# Altium schematic sheet 2_usb.SchDoc: USB
size A4; DocumentNumber: 3; SheetNumber: 3; SheetTotal: 11
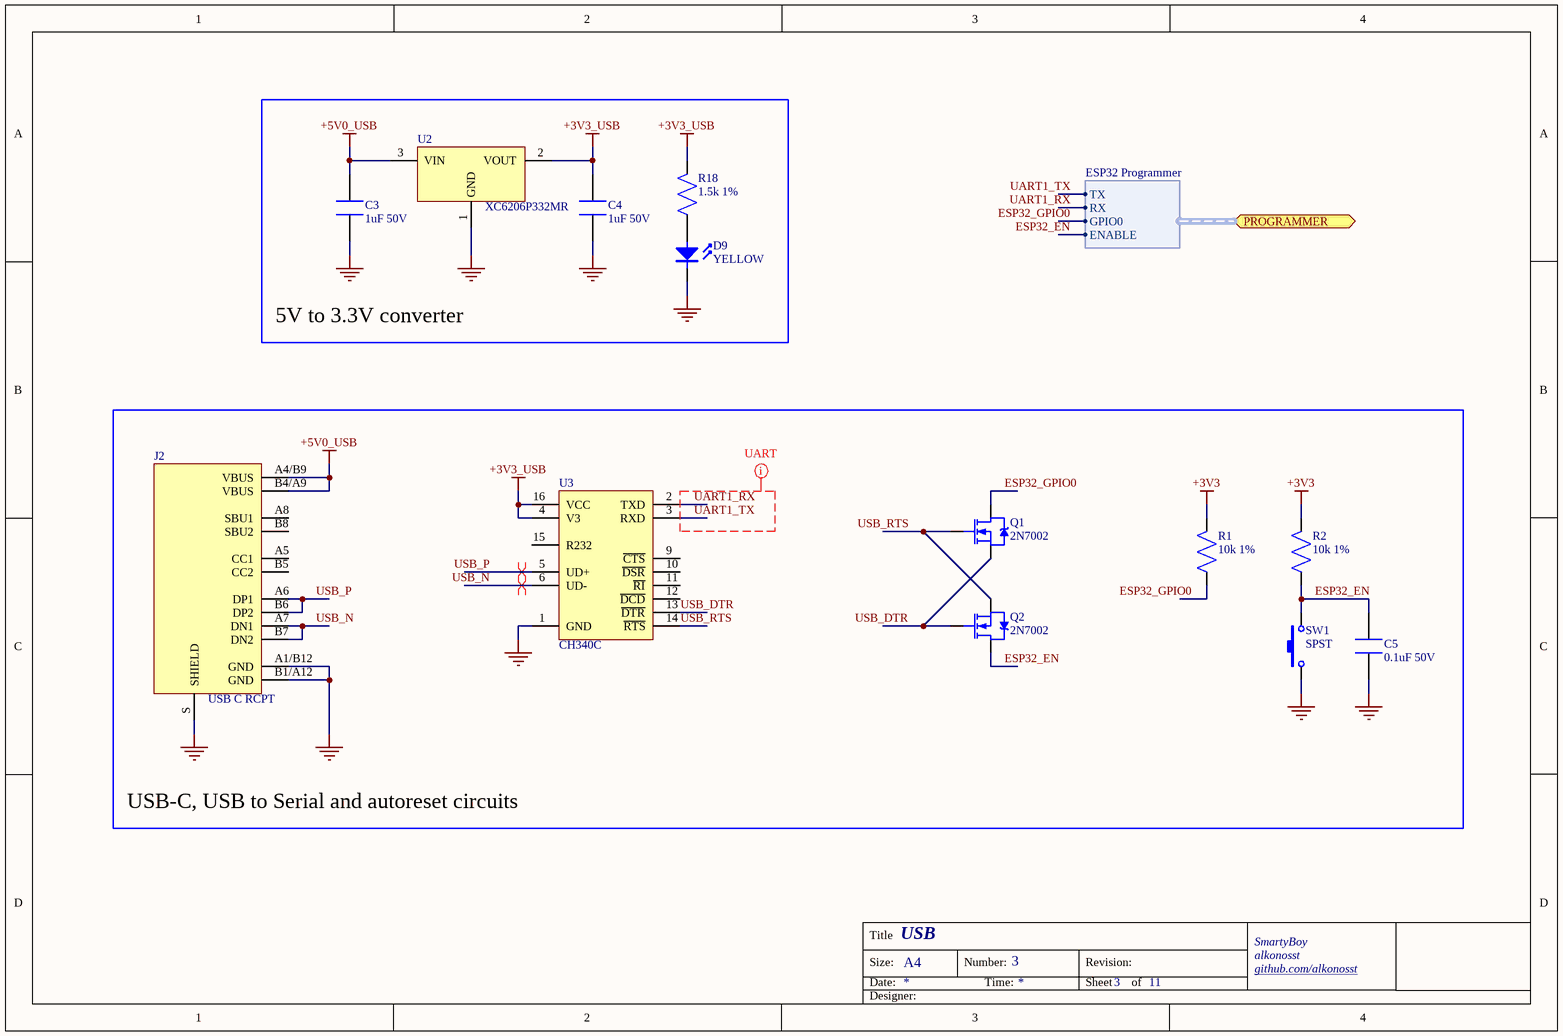
[diagram p0: 2_usb.SchDoc]

## Parts
C3  1uF 50V  [C0603]
C4  1uF 50V  [C0603]
C5  0.1uF 50V  [C0603]
D9  YELLOW  [LED0603-YELLOW]
J2  USB C RCPT  [USB-TYPE-C-RCPT]
Q1  2N7002  [SOT-23-3]
Q2  2N7002  [SOT-23-3]
R1  10k 1%  [R0603]
R2  10k 1%  [R0603]
R18  1.5k 1%  [R0603]
SW1  SPST  [SW-TS-1187A-B-A-B]
U2  XC6206P332MR  [SOT-23-3]
U3  CH340C  [SOP-16]

## Blocks framed on the sheet
5V to 3.3V converter: C3 C4 D9 R18 U2
USB-C, USB to Serial and autoreset circuits: C5 J2 Q1 Q2 R1 R2 SW1 U3

## Ports
PROGRAMMER (bidir, harness ESP32 Programmer)

## Harnesses
ESP32 Programmer: TX, RX, GPIO0, ENABLE

## Nets
+3V3: R1.2 R2.2
+3V3_USB: C4.1 R18.2 U2.2(VOUT) U3.4(V3) U3.16(VCC)
+5V0_USB: C3.1 J2.A4/B9(VBUS) J2.B4/A9(VBUS) U2.3(VIN)
GND: C3.2 C4.2 C5.2 D9.1 J2.A1/B12(GND) J2.B1/A12(GND) J2.S(SHIELD) SW1.1 U2.1(GND) U3.1(GND)
ESP32_EN: C5.1 Q2.3(D) R2.1 SW1.2 ; port PROGRAMMER.ENABLE
ESP32_GPIO0: Q1.3(D) R1.1 ; port PROGRAMMER.GPIO0
UART1_RX: U3.2(TXD) ; port PROGRAMMER.RX
UART1_TX: U3.3(RXD) ; port PROGRAMMER.TX
USB_DTR: Q1.2(S) Q2.1(G) U3.13(~{DTR})
USB_N: J2.A7(DN1) J2.B7(DN2) U3.6(UD-)
USB_P: J2.A6(DP1) J2.B6(DP2) U3.5(UD+)
USB_RTS: Q1.1(G) Q2.2(S) U3.14(~{RTS})
NetD9_2: D9.2 R18.1

Not connected (* = marked no-connect by the designer): J2 A5(CC1) A8(SBU1) B5(CC2) B8(SBU2); U3 7(NC1) 8(NC2) 9(~{CTS}) 10(~{DSR}) 11(~{RI}) 12(~{DCD}) 15(R232)

## Layout directives
differential pair: USB_N, USB_P
net class UART: UART1_RX, UART1_TX

## Notes on the sheet
- Title
- Size:
- Date:
- A4
- Number:
- Time:
- Revision:
- Sheet
- of
- SmartyBoy
- alkonosst
- github.com/alkonosst <http://github.com/alkonosst>
- Designer:

## Library data of the parts
C3 C4 = CL10A105KB8NNNC: X5R ±10% 50V 1uF 0603 Multilayer Ceramic Capacitors MLCC - SMD/SMT; LCSC part: C15849; Category: Capacitors: Multilayer Ceramic Capacitors MLCC - SMD/SMT
C5 = CC0603KRX7R9BB104: X7R 100nF ±10% 50V 0603 Multilayer Ceramic Capacitors MLCC - SMD/SMT; LCSC part: C14663; Category: Capacitors: Multilayer Ceramic Capacitors MLCC - SMD/SMT
D9 = 19-213/Y2C-CQ2R2L/3T(CY): Yellow 585.5~591.5nm 0603 Light Emitting Diodes (LED); LCSC part: C72038; Category: Optoelectronics: Light Emitting Diodes (LED)
J2 = TYPE-C-31-M-12: Receptacle USB Type C 16 Pins; LCSC part: C165948; Category: Connectors: USB Connectors
Q1 Q2 = 2N7002: 2.5V 250uA 0.115A 60V N Channel 7.5Ω 500mA,10V 0.2W SOT-23(SOT-23-3) MOSFETs; LCSC part: C8545; Category: Transistors: MOSFETs
R1 R2 = 0603WAF1002T5E: ±1% ±100ppm/℃ 10kΩ 0.1W 0603 Chip Resistor - Surface Mount; LCSC part: C25804; Category: Resistors: Chip Resistor - Surface Mount
R18 = 0603WAF1501T5E: 1.5kΩ ±1% ±100ppm/℃ 0.1W 0603 Chip Resistor - Surface Mount; LCSC part: C22843; Category: Resistors: Chip Resistor - Surface Mount
SW1 = TS-1187A-B-A-B: Top Actuated 50mA @ 12VDC Round Button 160gf SPST SMD Tactile Switches; LCSC part: C318884; Category: Pushbutton Switches & Relays: Tactile Switches
U2 = XC6206P332MR: 6V 680mV @ 100mA Fixed 3.3V SOT-23-3L Linear Voltage Regulators (LDO); LCSC part: C5446; Category: Power Management ICs: Linear Voltage Regulators (LDO)
U3 = CH340C: USB 2.0 Transceiver 2Mbps SOP-16_150mil USB ICs ROHS; LCSC part: C84681; Category: Interface ICs: USB ICs